# EAGLE design UWB_Light_Anchor (EAGLE 9.4.2)
COMPANY: ADAFRUIT INDUSTRIES; DRAWN: KTOWN; REV: G

## Sheet 1 of 2
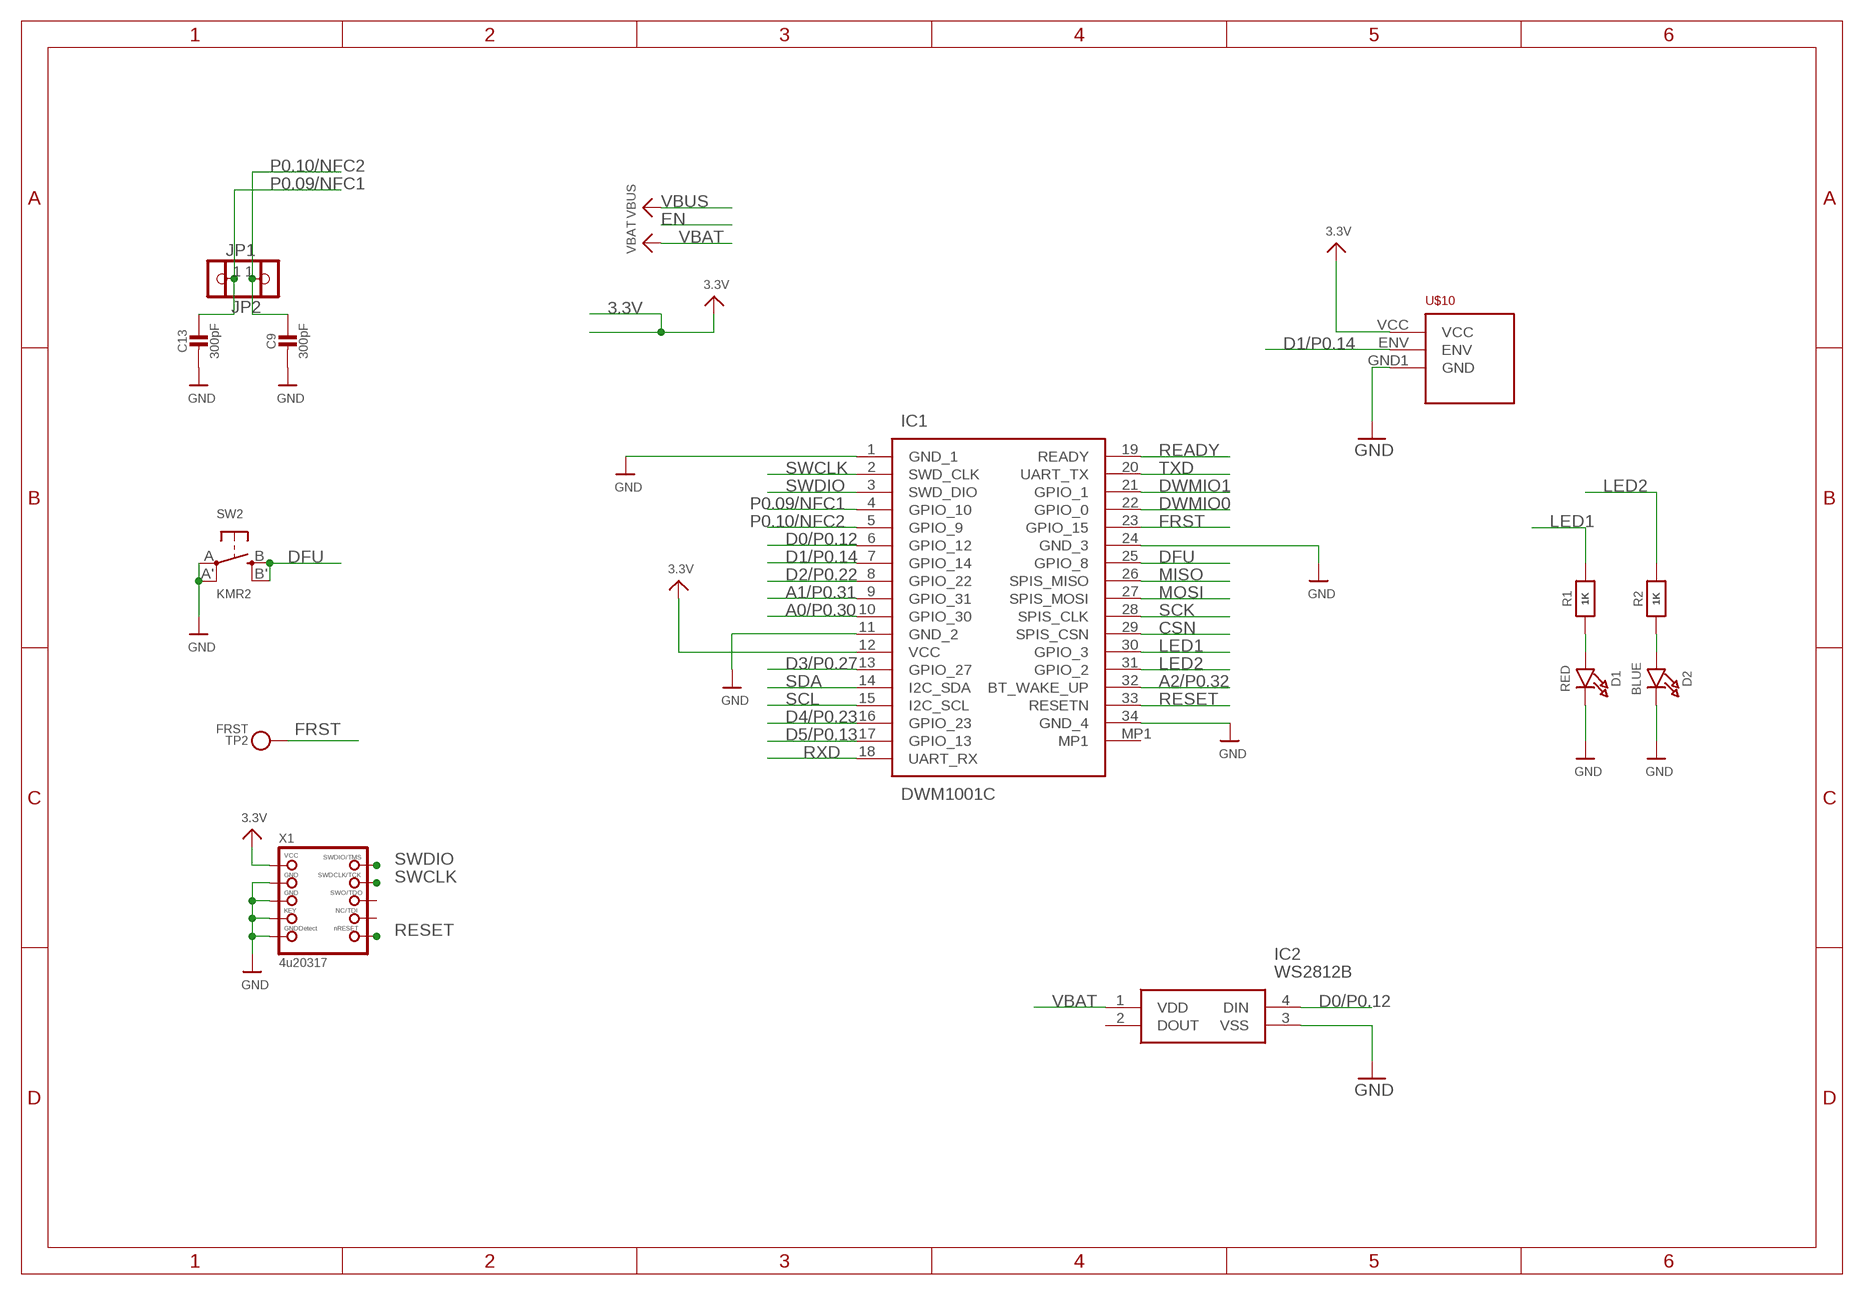
[diagram p0: schematic, sheet 1]

### Parts
C9  300pF  CAP_CERAMIC_0603MP  [_0603MP]
C13  300pF  CAP_CERAMIC_0603MP  [_0603MP]
D1  RED  LED0805_NOOUTLINE  [CHIPLED_0805_NOOUTLINE]
D2  BLUE  LED0805_NOOUTLINE  [CHIPLED_0805_NOOUTLINE]
IC1  DWM1001C  [DWM1001C]
IC2  WS2812B  [WS2812B]
JP1  HEADER-1X12MM  [1X01_2MM]
JP2  HEADER-1X12MM  [1X01_2MM]
R1  1K  RESISTOR_0603_NOOUT  [0603-NO]
R2  1K  RESISTOR_0603_NOOUT  [0603-NO]
SW2  KMR2  SWITCH_TACT_SMT4.6X2.8  [BTN_KMR2_4.6X2.8]
TP2  FRST  TESTPOINT1.5X2.0MM_NOCREAM  [PAD-1.5X2.0]
U$10  TS3633-CM1  [TS3633-CM1]
X1  4u20317  JTAG-CORTEXBOXPOSTS  [2X05_1.27MM_BOX_POSTS]

### Nets
3.3V: IC1.12(VCC) U$10.VCC X1.1(VCC) ; also sheet 2
A0/P0.30: IC1.10(GPIO_30) ; also sheet 2
A1/P0.31: IC1.9(GPIO_31)
A2/P0.32: IC1.32(BT_WAKE_UP)
CSN: IC1.29(SPIS_CSN)
D0/P0.12: IC1.6(GPIO_12) IC2.4(DIN)
D1/P0.14: IC1.7(GPIO_14) U$10.ENV
D2/P0.22: IC1.8(GPIO_22)
D3/P0.27: IC1.13(GPIO_27)
D4/P0.23: IC1.16(GPIO_23)
D5/P0.13: IC1.17(GPIO_13)
DFU: IC1.25(GPIO_8) SW2.B'(S1) SW2.B(S)
DWMIO0: IC1.22(GPIO_0)
DWMIO1: IC1.21(GPIO_1)
FRST: IC1.23(GPIO_15) TP2.P$1
GND: C9.2 C13.2 D1.C D2.C IC1.1(GND_1) IC1.11(GND_2) IC1.24(GND_3) IC1.34(GND_4) IC2.3(VSS) SW2.A'(P1) SW2.A(P) U$10.GND1(GND) X1.3(GND) X1.5(GND) X1.7(KEY) X1.9(GNDDETECT) ; also sheet 2
LED1: IC1.30(GPIO_3) R1.2
LED2: IC1.31(GPIO_2) R2.2
MISO: IC1.26(SPIS_MISO)
MOSI: IC1.27(SPIS_MOSI)
N$5: D1.A R1.1
N$7: D2.A R2.1
P0.09/NFC1: C13.1 IC1.4(GPIO_10) JP2.1
P0.10/NFC2: C9.1 IC1.5(GPIO_9) JP1.1
READY: IC1.19(READY)
RESET: IC1.33(RESETN) X1.10(NRESET) ; also sheet 2
RXD: IC1.18(UART_RX) ; also sheet 2
SCK: IC1.28(SPIS_CLK)
SCL: IC1.15(I2C_SCL)
SDA: IC1.14(I2C_SDA)
SWCLK: IC1.2(SWD_CLK) X1.4(SWDCLK)
SWDIO: IC1.3(SWD_DIO) X1.2(SWDIO)
TXD: IC1.20(UART_TX) ; also sheet 2
VBAT: IC2.1(VDD) ; also sheet 2
Unconnected: IC1.MP1 IC2.2(DOUT) X1.6(SWO) X1.8(TDI)

## Sheet 2 of 2
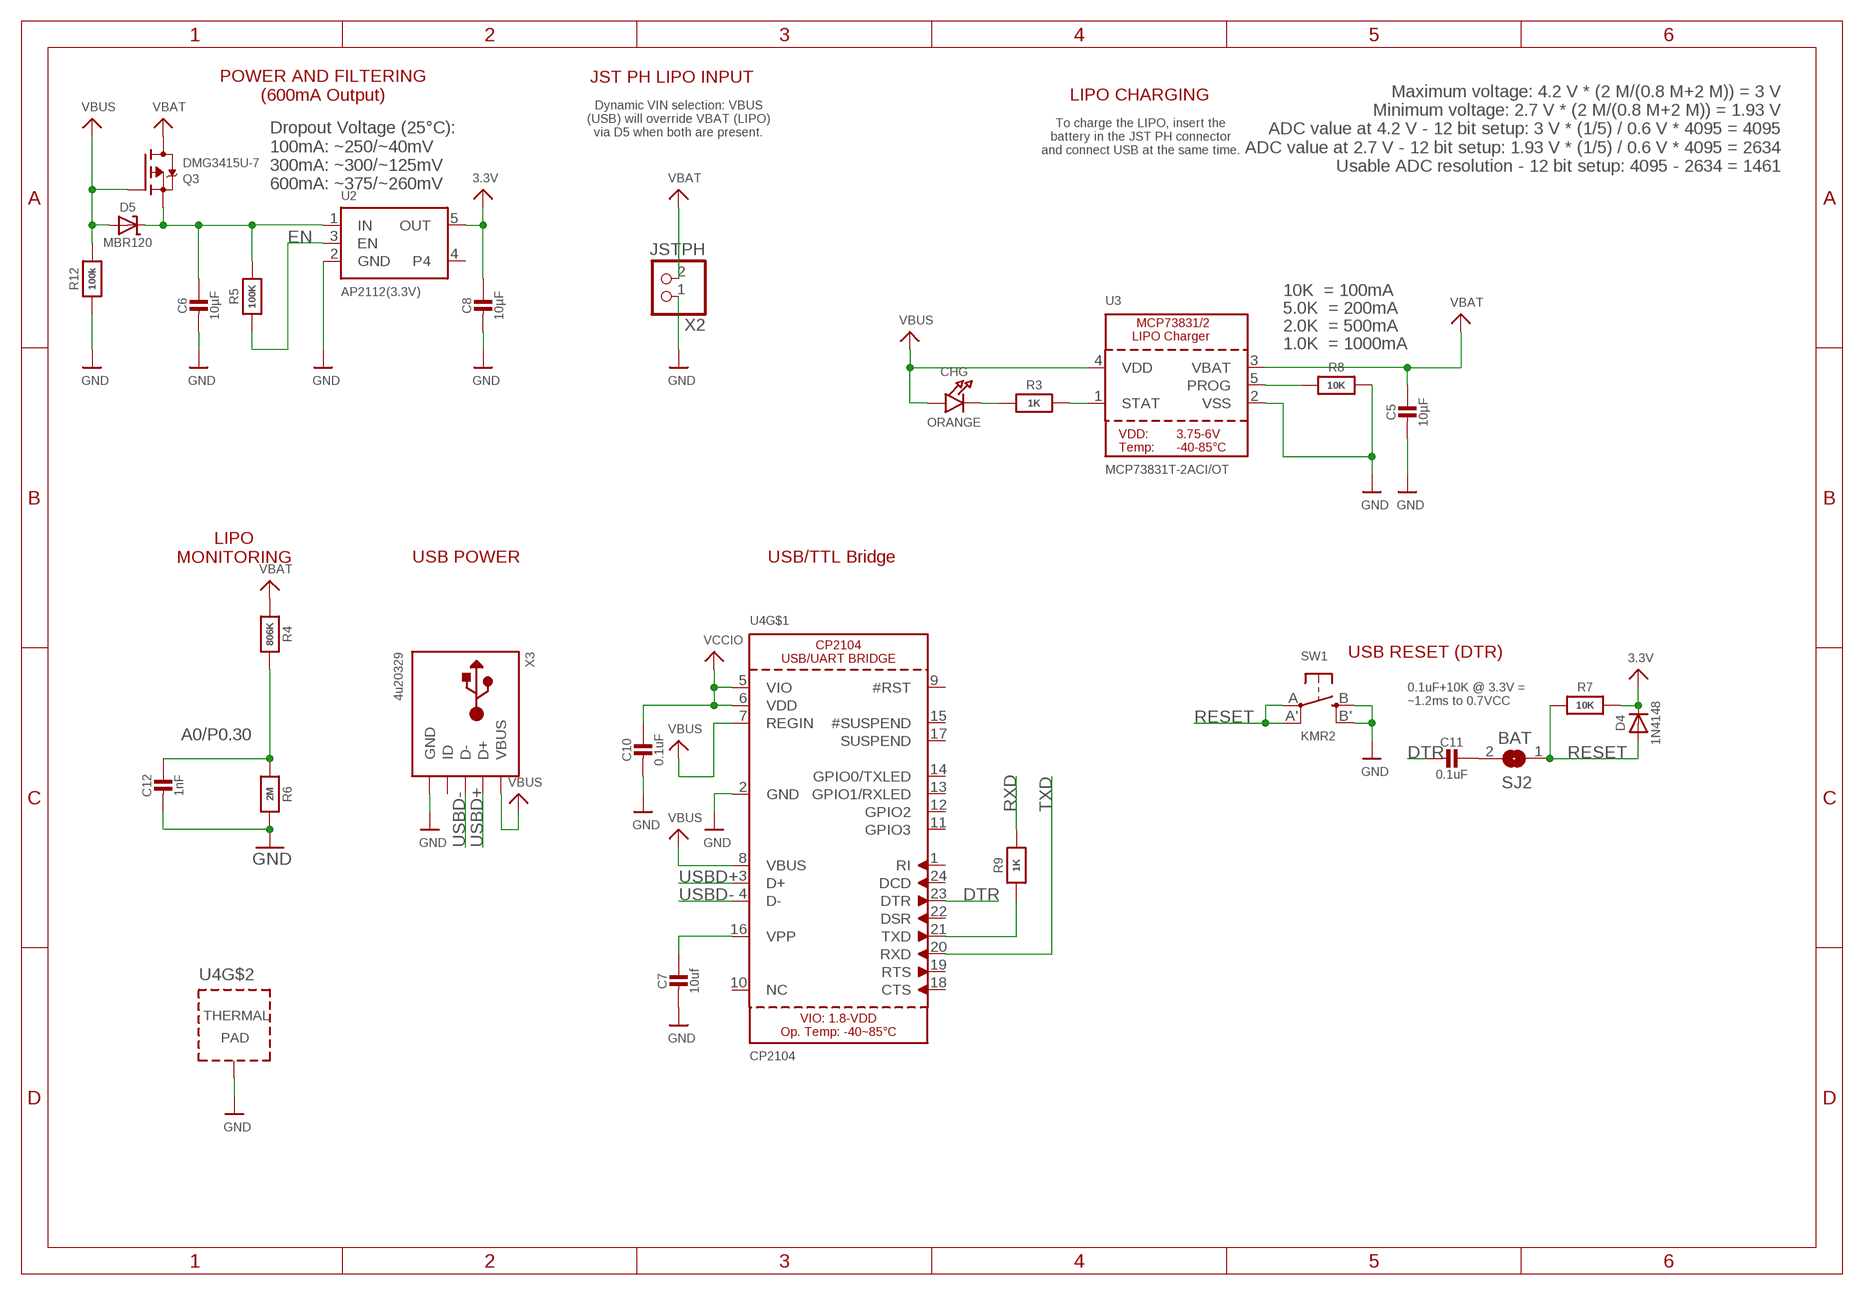
[diagram p1: schematic, sheet 2]

### Parts
C5  10µF  CAP_CERAMIC0805-NOOUTLINE  [0805-NO]
C6  10µF  CAP_CERAMIC0805-NOOUTLINE  [0805-NO]
C7  10uf  CAP_CERAMIC0805-NOOUTLINE  [0805-NO]
C8  10µF  CAP_CERAMIC0805-NOOUTLINE  [0805-NO]
C10  0.1uF  CAP_CERAMIC0603_NO  [0603-NO]
C11  0.1uF  CAP_CERAMIC0603_NO  [0603-NO]
C12  1nF  CAP_CERAMIC0603_NO  [0603-NO]
CHG  ORANGE  LED0805_NOOUTLINE  [CHIPLED_0805_NOOUTLINE]
D4  1N4148  DIODESOD-323  [SOD-323]
D5  MBR120  DIODE-SCHOTTKYSOD-123  [SOD-123]
Q3  DMG3415U-7  MOSFET-P  [SOT23-R]
R3  1K  RESISTOR_0603_NOOUT  [0603-NO]
R4  806K  RESISTOR_0603_NOOUT  [0603-NO]
R5  100K  RESISTOR_0603_NOOUT  [0603-NO]
R6  2M  RESISTOR_0603_NOOUT  [0603-NO]
R7  10K  RESISTOR_0603_NOOUT  [0603-NO]
R8  10K  RESISTOR_0603_NOOUT  [0603-NO]
R9  1K  RESISTOR_0603_NOOUT  [0603-NO]
R12  100k  RESISTOR_0603_NOOUT  [0603-NO]
SJ2  BAT  SOLDERJUMPERCLOSED  [SOLDERJUMPER_CLOSEDWIRE]
SW1  KMR2  SWITCH_TACT_SMT4.6X2.8  [BTN_KMR2_4.6X2.8]
U2  AP2112(3.3V)  VREG_SOT23-5  [SOT23-5]
U3  MCP73831T-2ACI/OT  MCP73831/2  [SOT23-5]
U4  CP2104  [QFN24_4MM_SMSC]
X2  JSTPH  CON_JST_PH_2PIN  [JSTPH2]
X3  4u20329  USB_MICRO_20329_V2  [4UCONN_20329_V2]

### Nets
3.3V: C8.1 D4.C R7.2 U2.5(OUT) ; also sheet 1
A0/P0.30: C12.1 R4.2 R6.1 ; also sheet 1
DTR: C11.2 U4.23(DTR)
EN: R5.1 U2.3(EN) ; also sheet 1
GND: C5.2 C6.2 C7.2 C8.2 C10.2 C12.2 R6.2 R8.2 R12.1 SW1.B'(S1) SW1.B(S) U2.2(GND) U3.2(VSS) U4.2(GND) U4.THERM(TP) X2.1 X3.BASE@1(GND) X3.BASE@2(GND) X3.GND X3.SPRT@1(GND) X3.SPRT@2(GND) X3.SPRT@3(GND) X3.SPRT@4(GND) ; also sheet 1
N$4: CHG.C R3.1
N$9: R3.2 U3.1(STAT)
N$10: R8.1 U3.5(PROG)
N$11: R9.1 U4.21(TXD)
N$13: C11.1 SJ2.2
N$14: C7.1 U4.16(VPP)
RESET: D4.A R7.1 SJ2.1 SW1.A'(P1) SW1.A(P) ; also sheet 1
RXD: R9.2 ; also sheet 1
TXD: U4.20(RXD) ; also sheet 1
USBD+: U4.3(D+) X3.D+
USBD-: U4.4(D-) X3.D-
VBAT: C5.1 Q3.3(D) R4.1 U3.3(VBAT) X2.2 ; also sheet 1
VBUS: CHG.A D5.A Q3.1(G) R12.2 U3.4(VDD) U4.7(REGIN) U4.8(VBUS) X3.VBUS ; also sheet 1
VCCIO: C10.1 U4.5(VIO) U4.6(VDD)
VIN: C6.1 D5.C Q3.2(S) R5.2 U2.1(IN)
Unconnected: U2.4 U4.1(RI) U4.9(#RST) U4.10(NC) U4.11(GPIO3) U4.12(GPIO2) U4.13(GPIO1/RXLED) U4.14(GPIO0/TXLED) U4.15(#SUSPEND) U4.17(SUSPEND) U4.18(CTS) U4.19(RTS) U4.22(DSR) U4.24(DCD) X3.ID

### Notes on the sheet
- JST PH LIPO INPUT
- POWER AND FILTERING
  (600mA Output)
- LIPO CHARGING
- Dynamic VIN selection: VBUS
  (USB) will override VBAT (LIPO)
  via D5 when both are present.
- To charge the LIPO, insert the
  battery in the JST PH connector
  and connect USB at the same time.
- Maximum voltage: 4.2 V * (2 M/(0.8 M+2 M)) = 3 V
  Minimum voltage: 2.7 V * (2 M/(0.8 M+2 M)) = 1.93 V
  ADC value at 4.2 V - 12 bit setup: 3 V * (1/5) / 0.6 V * 4095 = 4095
  ADC value at 2.7 V - 12 bit setup: 1.93 V * (1/5) / 0.6 V * 4095 = 2634
  Usable ADC resolution - 12 bit setup: 4095 - 2634 = 1461
- Dropout Voltage (25°C):
  100mA: ~250/~40mV
  300mA: ~300/~125mV
  600mA: ~375/~260mV
- 10K  = 100mA
- 5.0K  = 200mA
- 2.0K  = 500mA
- 1.0K  = 1000mA
- LIPO
  MONITORING
- USB POWER | USB/TTL Bridge
- USB RESET (DTR)
- 0.1uF+10K @ 3.3V =
  ~1.2ms to 0.7VCC

## Library data of the parts
C5-C13 = microbuilder:CAP_CERAMIC: Ceramic Capacitors For new designs, use the packages preceded by an '_' character since they are more reliable: The following footprints should be used on most boards: _0402 - Standard footprint for regular board layouts _0603 - Standard footprint for regular board layouts _0805 - Standard footprint for regular board layouts _1206 - Standard footprint for regular board layouts For extremely tight-pitch boards where space is at a premium, the following 'micro-pitch' footprints can be used (smaller pads, no silkscreen outline, etc.): _0402MP - Micro-pitch footprint for very dense/compact boards _0603MP - Micro-pitch footprint for very dense/compact boards _0805MP - Micro-pitch footprint for very dense/compact boards _1206MP - Micro-pitch footprint for very dense/compact boards
CHG D1 D2 = microbuilder:LED: LED 0603 - 0603 Surface Mount Package 2mA: Green LED - Low Power (3.9mcd, 2ma, 1.7Vf) - Digikey: 475-2709-2-ND Orange LED - Low Power (9.8mcd, 2ma, 1.8Vf) - Digikey: 475-1194-2-ND Red LED - Low Power (5mcd, 2ma, 1.8Vf) - Digikey: 475-1195-2-ND Yellow LED - Low Power (7mcd, 2ma, 1.8Vf) - Digikey: 475-1196-2-ND 5mA: Blue LED - Low Power (17mcd, 5ma, 2.9Vf) - Digikey: LNJ937W8CRACT-ND 0805 - 0805 Surface Mount Package 2mA: Red LED (8.8mcd, 2mA, 1.8Vf, Clear) - Low Power [Digikey: 475-2510-1-ND] Green LED (5mcd, 2mA, 1.8Vf, Clear) - Low Power [Digikey: 475-2730-1-ND] Yellow LED (11.3mcd, 2mA, 1.8Vf, Clear) - Low Power [Digikey: 475-2555-1-ND] 20mA: Red LED (104mcd, 20mA, Diffused) - LS R976 [Digikey: 475-1278-6-ND] Red LED (12mcd, 20mA, 2.0Vf, Clear) - APT2012EC [Digikey: 754-1128-1-ND] Green LED (15mcd, 20mA, 2.2Vf, Clear) - APT2012GC [Digikey: 754-1131-1-ND] Orange LED (160mcd, 20mA, 2.1Vf, Clear) - APT2012SECK [Digikey: 754-1130-1-ND] 1206 - 1206 Surface Mount Package Green LED (26mcd, 20mA, Diffused) - LG N971 [Digikey: 475-1407-6-ND] Red LED (15mcd, 20mA, Diffused) - LH N974 [Digikey: 475-1416-6-ND] Cree - Cree High-Power Surface Mount LEDs XPEBWT-L1-0000-00D50 - White 111lm 350mA 2.9Vf 6200K 110° XTEAWT-00-0000-00000LEE3 - White 114lm 350mA 2.85Vf 5000K 115° Everlight - Everlight 45-21 Series Surface Mount LEDs 45-21/QK2C-B2832AC2CB2/2T - Warm White 2000mcd 20mA 3.25Vf 3050K 120° 45-21/LK2C-B38452C4CB2/2T - Nuetral White 2000mcd 20mA 3.25Vf 4150K 120° 45-21/LK2C-B50634C6CB2/2T - Cold White 2200mcd 20mA 3.25Vf 5650K 120° PLCC2 Reverse Mount LS T77K-J1L2-1-0-2-R18-Z - Red 11.25mcd 2mA 1.8Vf 630nm 120° LO T77K-L1M2-24-Z - Orange 19.6mcd 2mA 1.8Vf 606nm 120° LY T77K-K2M1-26-Z - Yellow 15.7mcd 2mA 1.8Vf 587nm 120°
D4 = microbuilder:DIODE: Diode SMA Model Volts Amps Type Vf Ir Digikey # Notes SSA34-E3 40V 3A Schottky 480mV @ 3A 200uA @ 40V SSA34-E3/61TGITR-ND CDBA120-G 20V 1A Schottky 500mV @ 1A 500uA @ 20V 641-1014-6-ND REEL MBRA210 10V 2A Schottky 350mV @ 2A 700uA @ 10V MBRA210LT3 SOD-123 Model Volts Amps Type Vf Ir Order # Notes BAT54T1G 30V 200mA Schottky 800mV @ 200mA 2uA @ 25V BAT54T1GOSTR-ND B0530W 30V 500mA Schottky 430mV @ 500mA 130uA @ 30V B0530W-FDICT-ND REEL MBR120 20V 1A Schottky 340mV @ 1A MBR120VLSFT1GOSCT-ND SOD-323 Model Volts Amps Type Vf Ir Order # Notes PMEG2005EJ 20V 500mA Schottky 355mV @ 500mA 568-4110-1-ND ZLLS410 10V 570mA Schottky 380mV @ 570mA ZLLS410CT-ND 1N4148WS 75V 150mA Silicon/Simple 1V 1N4148WSFSCT-ND REEL SOD-523 Model Volts Amps Type Vf Ir Order # Notes BAT54XV2 30V 200mA Schottky 0.8V @ 100mA BAT54XV2CT-ND TB751S 30V 30mA Schottky RB751S-40TE61CT-ND SOT23-R/W (R = Solder Paste/Reflow Ovens, W = Hand-Soldering) Model Volts Amps Type Vf Ir Order # Notes BAT54FILM 40V 300mA Schottky 497-7162-1-ND POWERDI-5 Model Volts Amps Type Vf Ir Order # Notes PDS560 60V 5A Schottky 670mV @ 5A 150uA @ 60V PDS560DICT-ND
D5 = microbuilder:DIODE-SCHOTTKY
IC1 = DWM1001C:DWM1001C: RF TXRX MODULE UWB/BLUETOOTH RTL Source: Datasheet <https://www.decawave.com/wp-content/uploads/2019/01/DWM1001_Datasheet-1.4.pdf>; DESCRIPTION: RF TXRX MODULE UWB/BLUETOOTH RTL; HEIGHT: 3.4mm; MANUFACTURER_NAME: Decawave Limited; MANUFACTURER_PART_NUMBER: DWM1001C
IC2 = WS2812B:WS2812B: Intelligent control LED integrated light source Source: Datasheet <https://www.adafruit.com/datasheets/WS2812B.pdf>; DESCRIPTION: Intelligent control LED integrated light source; HEIGHT: mm; MANUFACTURER_NAME: Worldsemi; MANUFACTURER_PART_NUMBER: WS2812B
JP1 JP2 = microbuilder:HEADER-1X1: PIN HEADER
Q3 = microbuilder:MOSFET-P: P-Channel Mosfet LEGEND VDS: Voltage Drain-Source ID: Drain Current RDS(ON): Drain-Source On-State Resistance VGS(TH): Gate-Source Threshold Voltage CISS: Drain-Source Input Capacitance SOT-23 Name VDS ID RDS(ON) VGS(TH) CISS Order Number IRLML5103 30V 760mA 600 mOhm -- 75pF @ 25V Digikey: IRLML5103PBFCT-ND IRLML6401 12V 4.3A 50 mOhm 950mV @ 250µA 830pF @ 10V Digikey: IRLML6401PBFTR-ND NTR0202PL 20V 400mA 800 mOhm 2.3V @ 250uA 70pF @ 5V Digikey: NTR0202PLT1GOSTR-ND NTR4101PT1G 20V 1.8A 85 mOhm 1.2V @ 250uA 675pF @ 10V Digikey: NTR4101PT1GOSCT-ND DMP2004K 20V 600mA 900 mOhm 1V @ 250uA 175pF @ 16V Digikey: DMP2004KDICT-ND PMV65XP 20V 3.9A 76 mOhm 950mV @ 1mA 725pF @ 20V Digikey: 568-2358-2-ND TO-252 Name VDS ID RDS(ON) VGS(TH) CISS Order Number AOD417 30V 25A 34 mOhm 3V @ 250µA 920pF @ 15V Digikey: 785-1106-2-ND
R1-R9 R12 = microbuilder:RESISTOR: Resistors For new designs, use the packages preceded by an '_' character since they are more reliable: The following footprints should be used on most boards: _0402 - Standard footprint for regular board layouts _0603 - Standard footprint for regular board layouts _0805 - Standard footprint for regular board layouts _1206 - Standard footprint for regular board layouts For extremely tight-pitch boards where space is at a premium, the following 'micro-pitch' footprints can be used (smaller pads, no silkscreen outline, etc.): _0402MP - Micro-pitch footprint for very dense/compact boards _0603MP - Micro-pitch footprint for very dense/compact boards _0805MP - Micro-pitch footprint for very dense/compact boards _1206MP - Micro-pitch footprint for very dense/compact boards
SJ2 = microbuilder:SOLDERJUMPER: SMD Solder JUMPER Solder the two pads together to create a connection, or remove the solder to break it. REFLOW - Use this footprint for solder paste and reflow ovens. WAVE - Use this footprint for hand-soldering (larger pads). CLOSED - Has a trace between the two pads to ensure it is closed by default. The trace needs to be cut to disable the jumper, and can be closed again by creating a solder bridge between the two pads.
SW1 SW2 = microbuilder:SWITCH_TACT_SMT: SMT Tact Switches 6x6mm - Digikey: P12940SCT-ND KMR2 (4.6x2.8mm) - Digikey: 401-1426-1-ND EVQ-PQHB55 - Light Touch, 160GF (4.5x4.5mm) - Digikey: P8090SCT-ND KMT0 - KMT021 NGJ LHS (etc.) IP68/Waterproof - Digikey: CKN10289CT-ND
TP2 = microbuilder:TESTPOINT: Test Point Various test points for characterisation and PCB testing TESTPOINT_SMT - Compact Surface Mount Test Point [Digikey: 5016KTR-ND]
U2 = microbuilder:VREG_SOT23-5: SOT23-5 Fixed Voltage Regulators Part Current Out V Out V In V Dropout θJA (°C/W) TJ (°C) Digikey Part No. ADP121 150mA 3.3V 3.4-5.5V 0.09V @ 150mA -- -- ADP121-AUJZ33R7CT-ND ADP121 150mA 3.0V 3.1-5.5V 0.09V @ 150mA -- -- ADP121-AUJZ30R7CT-ND ADP122 300mA 3.3V 3.4-5.5V 0.085V @ 300mA -- -- ADP122AUJZ-3.3-R7CT-ND ADP1712 300mA 3.3V 3.5-5.5V 0.17V @ 300mA -- -- ADP1712AUJZ-3.3-R7TR-ND AP7311 (Low Cost) 150mA 3.3V 3.5-6V 0.15V @ 150mA -- -- AP7311-33WG-7DICT-ND LD39015M18R 150mA 1.8V 1.9V-5.5V 0.08V @ 100mA -- -- 497-6977-1-ND LP2985A-33DBVR 150mA 3.3V 3.3-16V 0.28V @ 150mA 206 150 296-18479-1-ND MCP1824T-3302E/OT 300mA 3.3V 3.5V-6V 0.2V @ 300mA -- -- MCP1824T-3302E/OTCT-ND MIC5205-2.5YM5 TR 150mA 2.5V 2.7-16V 0.165V @ 150mA -- -- 576-1257-2-ND MIC5205-3.0YM5 TR 150mA 3.0V 3.2V-16V 0.165V @ 150mA -- -- 576-1258-2-ND MIC5205-3.3YM5 TR 150mA 3.3V 3.5V-16V 0.165V @ 150mA -- -- 576-1259-2-ND TPS780330220 150mA 3.3V+2.2V 3.6-5.5V 250mV Max -- -- 296-23332-1-ND TDA3663/N1,135 100mA 3.3V 3.5-45V 0.18V @ 50mA -- -- 568-5343-1-ND Max operating temp can be calculated using θJA, TJ (max junction temperature), and power in watts. Set the "Maximum Ambient Temperature" until it reaches TJ ("Max Junction Temperature"), which is the absolute limit for safe use of the regulator: Heat Sink Temperature Calculator <http://www.daycounter.com/Calculators/Heat-Sink-Temperature-Calculator.phtml> For example, With 12V source into a 3.3V LP2985 and a 30mA load, we are dissipating (12V-3.3V) * 0.03A = 0.261W. With a θJA of 206 °C/W, a TJ of 150°C, and 261mW we can safely use the chip without a heat sink up to 75°C (=147.1°C Junction Temperature).
U3 = microbuilder:MCP73831/2: MCP73831/2 LIPO Charger VDD: 3.75 - 6V Temp -40 - 85°C Programmable Charge Rate: 15-500mA NOTE: STAT is a tri-state logic output on the MCP73831 and an open-drain output on the MCP73832. SOT23-5 with 4.2V output and tri-state logic on STAT = MCP73831T-2ACI/OT
U4 = microbuilder:CP2104: CP2104 - USB to UART Bridge VDD Output: 3.45V
U$10 = TS3633-CM1:TS3633-CM1: Triad’s TS3633-CM1 is a rapid-prototyping solution for creating a SteamVR™ Tracked Object. The TS3633-CM1 is a complete Light-to-Digital Converter on an easy to solder castellated module. The CM1 contains all the circuitry necessary to convert SteamVR Tracking base station infrared light into a digital output that encodes the angle of the sensor from the base station.
X1 = microbuilder:JTAG-CORTEX: Serial Wire (SW-DP) Connector Standard 0.05" 10-pin connector is for use with the Cortex M and Cortex A SWD (serial wire debugger) interface (SW-DP) Connectors 2x05_1.27MM_SMT - Inexpensive surface-mount header with bare pins, compatible with standard 10-pin SWD cables (4UCON: 16846) 2x05_1.27MM_BOX_NOPOSTS - Polarised surface-mount box (4UCON with caps: 19735, without caps: 15117 2x05_1.27MM_BOX_POSTS - Polarised surface-mount box with mounting holes (4UCON: 20317) Pinout: http://infocenter.arm.com/help/topic/com.arm.doc.faqs/attached/13634/cortex_debug_connectors.pdf http://www.keil.com/peripherals/coresight/connectors.asp
X2 = microbuilder:CON_JST_PH_2PIN: JST 2-Pin Right-Angle Connector PH-Series - 4UConnector: 17311 SH-Series - 4UConnector: 07278
X3 = microbuilder:USB: USB Connectors USBMINIB - Surface Mount Female Mini-B USB Connector 4UConnector: 06564

## Net classes
3 usbvcc: width 0.305 mm, drill 0.483 mm, clearance 0.203 mm

## Board
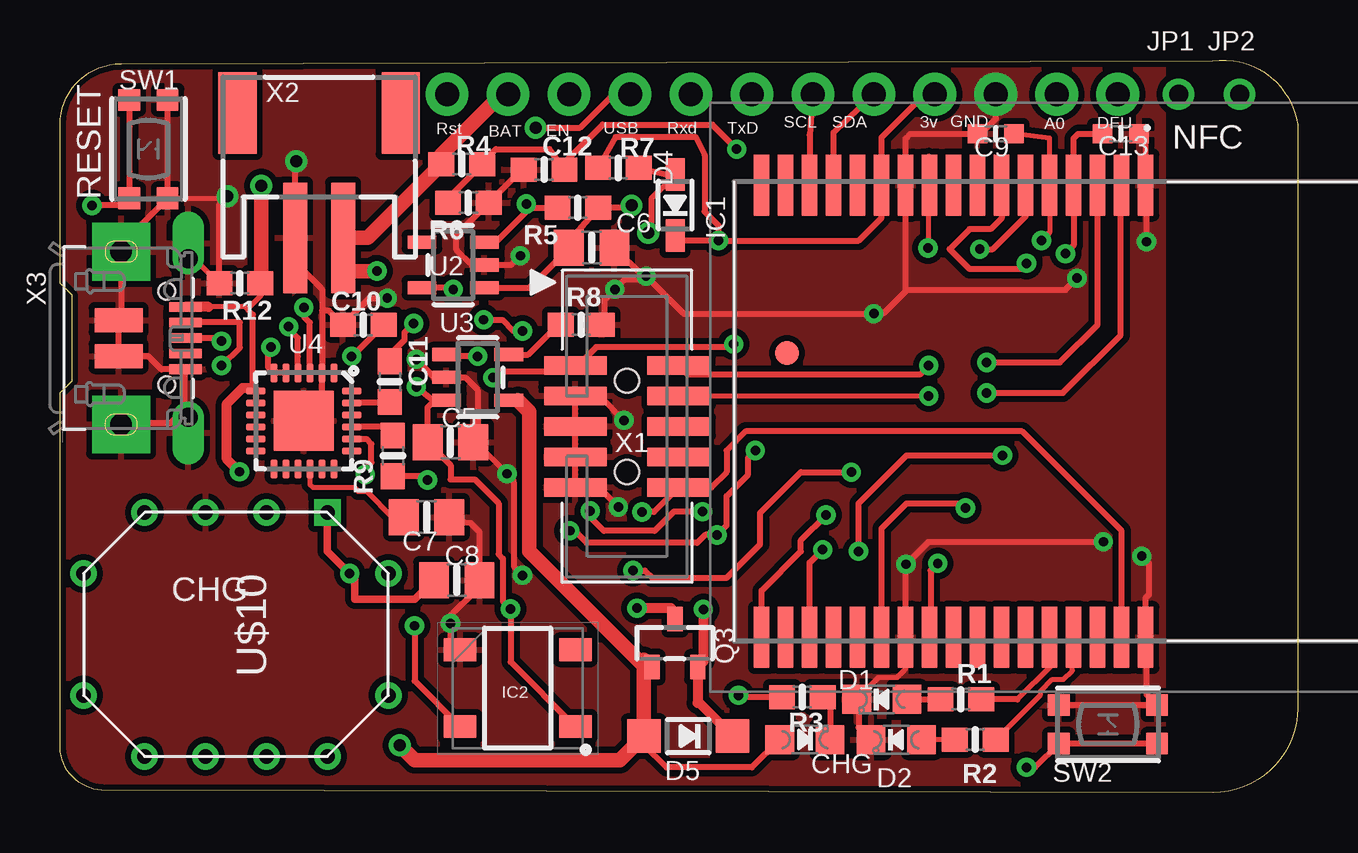
[diagram p2: board, top side]
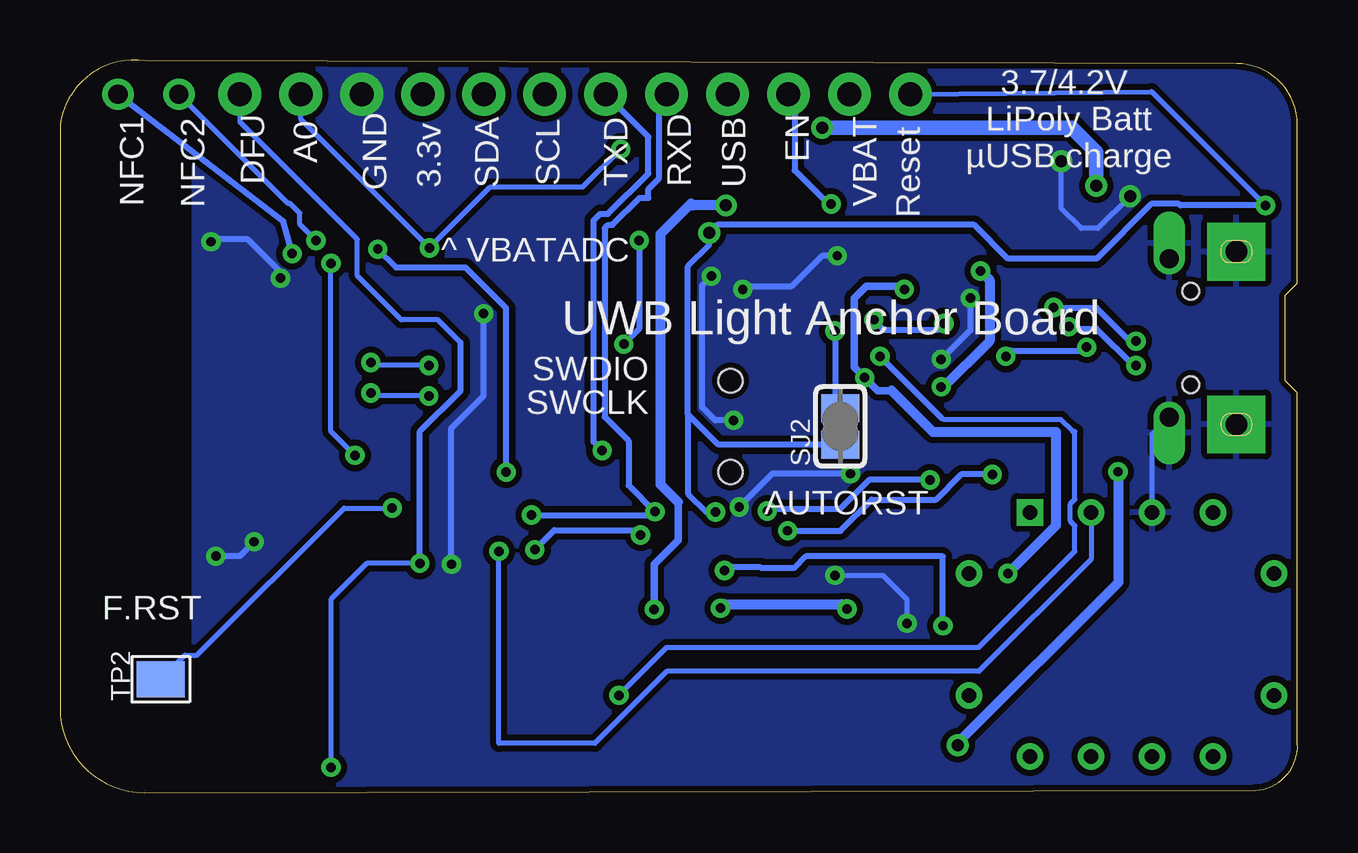
[diagram p3: board, bottom side, seen from below]

Size 51.56 x 30.53 mm. Coordinates in mm from the lower left corner, seen from the top.
Outline: 51.56,27.83 51.56,3.52 arc-90 48.04,0 1.74,0.1 arc-90 0,2.05 0,16.66 0.51,17.16 0.51,20.72 0,21.23 0,27.83 arc-90 2.54,30.37 48.01,30.5 arc-90 51.56,27.83
Copper layers (1*16): Top 0.035mm / dielectric 1.5mm / Bottom 0.035mm
Design rules "adafruit *": minimum track width 8mil, minimum drill 15.5mil, track to track 8mil, track to pad 8mil, pad to pad 8mil, via to via 8mil, smd to smd 8mil, copper to edge 10mil, drill to drill 8mil, minimum pad ring 10mil, minimum via ring 8mil, stop-mask expansion 2mil, vias tented up to drill 20mil, thermal gap 10mil

### Footprints (pad centres in the part's own frame; a part is rotated, then mirrored left to right if it is on the bottom)
0805-NO = smd 1.24 x 1.5: 1 -0.95,0; 2 0.95,0
_0603MP = smd 0.8 x 0.8: 1 -0.762,0; 2 0.762,0
0603-NO = smd 1.075 x 1: 1 -0.85,0; 2 0.85,0
CHIPLED_0805_NOOUTLINE = smd 1.2 x 1.2: A 0,-1.05; C 0,1.05
SOD-323 = smd 1.35 x 0.8: A 1.27,0; C -1.27,0
SOD-123 = smd 1.4 x 1.4: A 1.85,0; C -1.85,0
DWM1001C = smd 2.54 x 0.65: 1 -9.42,4.085; 2 -9.42,3.085; 3 -9.42,2.085; 4 -9.42,1.085; 5 -9.42,0.085; 6 -9.42,-0.915; 7 -9.42,-1.915; 8 -9.42,-2.915; 9 -9.42,-3.915; 10 -9.42,-4.915; 11 -9.42,-5.915; 12 -9.42,-6.915; 13 -9.42,-7.915; 14 -9.42,-8.915; 15 -9.42,-9.915; 16 -9.42,-10.915; 17 -9.42,-11.915; 18 9.42,-11.915; 19 9.42,-10.915; 20 9.42,-9.915; 21 9.42,-8.915; 22 9.42,-7.915; 23 9.42,-6.915; 24 9.42,-5.915; 25 9.42,-4.915; 26 9.42,-3.915; 27 9.42,-2.915; 28 9.42,-1.915; 29 9.42,-0.915; 30 9.42,0.085; 31 9.42,1.085; 32 9.42,2.085; 33 9.42,3.085; 34 9.42,4.085 | smd 1 x 1: MP1 -2.435,-10.865
WS2812B = smd 1.35 x 0.95: 1 -2.4,1.6; 2 -2.4,-1.6; 3 2.4,-1.6; 4 2.4,1.6
1X01_2MM = drill 0.8 pad 1.27: 1 0,0
SOT23-R = smd 0.635 x 1.016: 1 -0.95,-1; 2 0.95,-1; 3 0,1
SOLDERJUMPER_CLOSEDWIRE = smd 1.168 x 1.6: 1 -0.762,0; 2 0.762,0 | smd 0.635 x 0.203: WIRE 0,0
BTN_KMR2_4.6X2.8 = smd 0.9 x 0.9: A 2.05,0.8; A' -2.05,0.8; B 2.05,-0.8; B' -2.05,-0.8
PAD-1.5X2.0 = smd 1.5 x 2: P$1 0,0
SOT23-5 = smd 0.55 x 1.2: 1 -0.95,-1.3; 2 0,-1.3; 3 0.95,-1.3; 4 0.95,1.3; 5 -0.95,1.3
QFN24_4MM_SMSC = smd 0.8 x 0.28: 1 -2,1.25; 2 -2,0.75; 3 -2,0.25; 4 -2,-0.25; 5 -2,-0.75; 6 -2,-1.25; 13 2,-1.25; 14 2,-0.75; 15 2,-0.25; 16 2,0.25; 17 2,0.75; 18 2,1.25 | smd 0.28 x 0.8: 7 -1.25,-2; 8 -0.75,-2; 9 -0.25,-2; 10 0.25,-2; 11 0.75,-2; 12 1.25,-2; 19 1.25,2; 20 0.75,2; 21 0.25,2; 22 -0.25,2; 23 -0.75,2; 24 -1.25,2 | smd 2.5 x 2.5: THERM 0,0
TS3633-CM1 = drill 0.6: ENV -7.62,5.08; GND1 -7.62,2.54; GND2 2.54,2.54; NC1 -7.62,0; NC2 2.54,7.62; NC3 2.54,5.08; NC4 2.54,0; P$9 -5.08,-2.54; P$10 0,-2.54; P$11 -5.08,10.16; P$12 0,10.16 | drill 0.6 square: VCC -7.62,7.62
2X05_1.27MM_BOX_POSTS = smd 0.76 x 2.6: 1 -2.54,-2.15; 2 -2.54,2.15; 3 -1.27,-2.15; 4 -1.27,2.15; 5 0,-2.15; 6 0,2.15; 7 1.27,-2.15; 8 1.27,2.15; 9 2.54,-2.15; 10 2.54,2.15 | hole 1: -1.905,0; 1.905,0
JSTPH2 = smd 1 x 4.6: 1 -1,-3.7; 2 1,-3.7 | smd 1.6 x 3.4: NC1 -3.4,1.5; NC2 3.4,1.5
4UCONN_20329_V2 = smd 1 x 2: BASE@1 -0.75,-2; BASE@2 0.75,-2 | smd 0.4 x 1.35: D+ 0,0.775; D- -0.65,0.775; GND 1.3,0.775; ID 0.65,0.775; VBUS -1.3,0.775 | drill 0.8 pad 1.143 offset: SPRT@1 -3.3,0.9; SPRT@2 3.3,0.9 | drill 0.9 pad 2.413 square: SPRT@3 -3.6,-1.9; SPRT@4 3.6,-1.9 | hole 0.7: -1.95,0; 1.95,0

### Placement (x,y rotation side)
C5  16.27,14.6 0 top
C6  22.15,22.71 0 top
C7  15.27,11.49 0 top
C8  16.53,8.85 0 top
C9  38.99,27.45 180 top
C10  12.64,19.5 180 top
C11  13.74,17.12 270 top
C12  20.17,25.96 180 top
C13  44.2,27.45 0 top
CHG  31.03,2.21 270 top
D1  34.25,3.89 90 top
D2  34.84,2.2 90 top
D4  25.63,24.48 90 top
D5  26.18,2.35 180 top
IC1  41.15,15.89 270 top
IC2  19.07,4.35 180 top
JP1  46.61,29.1 0 top
JP2  49.15,29.1 0 top
Q3  25.62,6.23 0 top
R1  37.54,3.89 0 top
R2  38.14,2.21 0 top
R3  30.93,3.98 180 top
R4  16.74,26.19 0 top
R5  21.58,24.38 0 top
R6  17.02,24.58 0 top
R7  23.27,26.03 180 top
R8  21.72,19.5 0 top
R9  13.87,14.03 270 top
R12  7.49,21.23 0 top
SJ2  19.05,15.26 90 bottom
SW1  3.68,26.82 90 top
SW2  43.66,2.85 0 top
TP2  47.36,4.73 270 bottom
U2  16.38,21.99 90 top
U3  17.4,17.3 270 top
U4  10.16,15.49 270 top
U$10  3.52,4.05 270 top
X1  23.62,15.26 270 top
X2  10.8,26.82 0 top
X3  4.45,18.94 270 top

### Tracks (layer width: path | path; a pad name or v marks a point on that pad's centre or on a via)
3.3V  (via drill 0.39, 1 pad 1.78)
  Top 0.203: 21.52,17.75 X1.1 | 25.83,23.01 D4.C
  Top 0.254: R7.2 23.15,27.32 26.48,27.32 26.86,26.56 26.86,24.21 27.43,23.64 v27.43,23.01 | v16.38,20.97 16.32,21.04 U2.5 | X1.1 21.22,17.54 18.29,17.54 v18.04,17.29 | 21.52,17.75 22.34,18.56 27.94,18.56 v28.07,18.69 | v27.43,23.01 25.83,23.01 | v27.43,23.01 33.28,23.01 34.23,23.96 IC1.12 34.23,27.3 36.07,29.14 v36.45,29.1
  Top 0.305: C8.1 14.78,8.05 12.27,8.05 12.27,8.93 v12.07,9.13 11.14,10.06 U$10.VCC
  Bottom 0.254: v27.43,23.01 27.43,19.32 v28.07,18.69
  Bottom 0.305: 16.92,16.75 17.5,16.75 v18.04,17.29 18.48,17.73 18.48,20.59 17.97,21.1 16.51,21.1 v16.38,20.97
  Bottom 0.406: v12.07,9.13 10.07,11.13 10.07,15.03 15.2,15.03 16.92,16.75
A0/P0.30  (via drill 0.39, 1 pad 1.78)
  Top 0.203: IC1.10 36.23,26.51 36.17,26.51 v36.17,22.7
  Top 0.254: R6.1 16.17,24.77 R4.2 17.84,26.45 17.84,26.5 18.16,26.82 20.39,26.82 C12.1 21.02,26.24 22.61,27.83 27.18,27.83 v28.2,26.81
  Bottom 0.203: v28.2,26.81 29.77,25.24 33.63,25.24 v36.17,22.7 41.53,28.06 v41.53,29.1
D0/P0.12  (via drill 0.39)
  Top 0.254: v23.87,9.25 24.37,9.25 24.67,8.95 25.27,8.95 25.28,8.95 27.77,8.95 29.17,10.35 29.17,11.65 30.87,13.35 v32.97,13.35 | IC1.6 40.23,24.02 38.86,22.64 v38.32,22.64 | v14.77,6.95 14.77,4.65 IC2.4
  Bottom 0.254: v14.77,6.95 14.77,9.85 20.48,9.85 20.97,9.35 22.34,9.35 22.37,9.38 23.74,9.38 v23.87,9.25 | v32.97,13.35 32.97,20.18 34.67,21.88 37.56,21.88 v38.32,22.64
D1/P0.14  (via drill 0.39)
  Top 0.254: v33.27,10.05 33.27,12.05 35.27,14.05 v39.27,14.05 | v40.27,22.05 40.03,21.81 37.9,21.81 37.07,22.64 37.9,23.48 38.78,23.48 39.23,23.93 IC1.7
  Bottom 0.203: U$10.ENV 8.6,9.72 13.27,5.05 26.27,5.05 29.27,2.05 33.27,2.05 v33.27,10.05 | v39.27,14.05 40.27,15.05 v40.27,22.05
DFU  (via drill 0.39, 1 pad 1.78)
  Top 0.254: SW2.B SW2.B' 40.62,1.05 v40.27,1.05 | IC1.25 36.27,6.51 36.27,9.25 v36.57,9.55
  Bottom 0.203: v44.07,29.1 44.07,27.95 39.17,23.05 39.17,21.54 37.34,19.7 35.82,19.7 34.87,18.75 | v36.57,9.55 38.77,9.55 40.27,8.05 v40.27,1.05
  Bottom 0.254: v36.57,9.55 36.57,15.05 34.87,16.75 34.87,18.75
DTR
  Top 0.254: C11.2 13.7,16.24 U4.23
EN  (via drill 0.39, 1 pad 1.78)
  Top 0.203: v19.43,24.53 19.58,24.38
  Top 0.254: R5.1 19.58,24.38 18.15,22.94 U2.3
  Bottom 0.254: v21.21,29.1 20.82,28.71 20.96,28.37 20.96,25.93 19.56,24.53 v19.43,24.53
FRST  (via drill 0.39)
  Top 0.254: IC1.23 34.23,11.02 35.27,12.05 37.53,12.05 v37.73,11.86
  Bottom 0.203: TP2.P$1 46.36,5.73 45.86,5.73 39.73,11.86 v37.73,11.86
GND  (via drill 0.39, 0.5, 1 pad 1.78)
  Top 0.203: R8.2 22.75,19.68 | 45.23,27.18 C13.2 | X2.1 9.8,22.1 | U4.2 10.92,17.5 | 45.23,7.05 IC1.34 45.27,6.44 | C7.2 16.41,11.3 | IC2.3 16.27,6.35 | C5.2 17.32,14.6 v18.63,13.29 18.91,13 18.91,12.91 | X3.SPRT@1 5.47,22.37 6.61,21.23 R12.1 | SW1.B' 6.89,24.77 v6.98,24.85 | X3.SPRT@2 5.18,15.81 5.18,15.98 | D1.C 34.1,4.79 34.87,4.79 35.23,5.15 IC1.24
  Top 0.254: C12.2 19.17,25.88 R6.2 16.51,23.22 16.51,22.62 17.15,21.99 U2.2 18.8,21.99 v19.18,22.37 | SW2.A' SW2.A 45.27,4.09 45.27,6.44 | SW1.B SW1.B' 2.55,22.83 X3.SPRT@3 2.55,19.79 X3.BASE@1 X3.BASE@2 3.67,18.19 4.22,17.64 X3.GND 5.18,17.6 5.18,15.98 4.58,15.39 2.59,15.39 X3.SPRT@4 | 45.23,27.18 IC1.1 45.27,25.28 v45.27,22.95 | X2.1 9.8,26.26 v9.84,26.31 | R12.1 6.64,24.52 v6.98,24.85 | 9.8,22.1 10.92,20.97 10.92,20.08 | 10.92,20.08 10.92,17.5 | U4.2 10.91,16.49 10.16,15.74 U4.THERM | 22.75,19.68 22.69,19.75 22.69,20.55 v23.12,20.97 23.53,21.39 24.55,21.39 | 35.23,20.9 IC1.11 35.23,27.25 35.43,27.45 C9.2 38.36,27.45 38.99,28.09 v38.99,29.1 | C6.2 24.3,21.52 v24.42,21.52 24.55,21.39 | 24.55,21.39 25.98,19.96 v33.91,19.96 34.29,19.96 35.23,20.9 | C5.2 17.4,14.78 17.4,16.78 16.88,17.3 U3.2 15.6,17.3 v14.85,18.05 | v23.26,11.9 22.45,12.72 X1.9 X1.7 X1.5 X1.3 22.48,16.53 v23.5,15.51 | 10.92,20.08 11.2,20.08 C10.2 12.89,20.6 v13.63,20.6 | IC1.24 35.23,9.54 v35.25,9.52 36.17,10.44 36.17,10.45 v43.47,10.45 | v45.07,9.85 45.37,9.55 45.37,8.25 45.23,8.12 45.23,7.05 | 35.23,20.9 35.29,20.95 41.89,20.95 v42.37,21.44 | 16.41,11.3 17.1,11.23 17.48,10.86 C8.2 17.48,8.57 16.15,7.24 16.15,7.18 v16.27,7.05 16.27,6.35 | v19.27,9.05 18.91,9.41 18.91,12.91 | D1.C 33.28,3.81 33.28,2.72 D2.C
  Bottom 0.203: v6.98,24.85 8.31,23.51 9.02,23.51 9.84,24.34 v9.84,26.31 | v19.27,9.05 17.27,9.05 16.27,8.05 v16.27,7.05 | U$10.GND1 6.06,14.93 X3.SPRT@2
  Bottom 0.254: v19.18,22.37 19.81,22.37 21.08,21.1 22.99,21.1 v23.12,20.97 | v18.63,13.29 21.88,13.29 v23.26,11.9 | v13.63,20.6 13.63,19.26 v14.85,18.05 | v35.25,9.52 35.25,15.19 33.91,16.53 v33.91,19.96 | v24.42,21.52 24.8,21.14 24.8,16.06 24.26,15.51 v23.5,15.51 | v43.47,10.45 44.07,9.85 v45.07,9.85 | v42.37,21.44 42.37,21.69 43.73,23.05 45.27,23.05 v45.27,22.95
  pour Bottom (isolate 0.254): 45.98,0 0,0 0,30.37 45.98,30.37
  pour Top (isolate 0.254): 45.95,0 0,0 0,30.37 45.95,30.37
LED1
  Top 0.203: IC1.30 41.25,6.45 41.25,5.25 39.89,3.89
  Top 0.254: 39.89,3.89 R1.2
LED2
  Top 0.203: IC1.31 42.18,6.42 42.18,5.09 41.81,4.72 41.35,4.72 40.86,4.22 40.86,4.08 R2.2
N$4
  Top 0.254: R3.1 32.08,3.68 CHG.C
N$5
  Top 0.254: D1.A R1.1
N$7
  Top 0.203: R2.1 D2.A
  Top 0.254: D2.A
N$9  (via drill 0.39)
  Top 0.254: v17.4,18.18 16.17,18.18 U3.1 | R3.2 28.34,3.98 v28.27,4.05
  Bottom 0.203: v28.27,4.05 26.27,6.05 13.27,6.05 9.27,10.05 9.27,11.13 9.46,11.32 9.46,12.03 9.27,12.22 9.27,15.05 9.38,15.05 9.86,15.54 14.76,15.54 14.83,15.6
  Bottom 0.254: v17.4,18.18 14.83,15.6
N$10
  Top 0.254: U3.5 19.51,18.25 20.75,19.5 R8.1
N$11
  Top 0.254: U4.21 13.56,15.24 13.87,14.92 R9.1
N$13  (via drill 0.39)
  Top 0.254: v17.65,19.7 18.42,19.7 18.89,19.23 v19.27,19.23 | v14.73,19.55 14.36,19.17 14.36,18.86 13.74,18.25 C11.1
  Bottom 0.254: v17.65,19.7 17.25,19.3 14.99,19.3 v14.73,19.55 | v19.27,19.23 19.27,16.24 SJ2.2
N$14
  Top 0.203: 13.84,11.49 12.77,12.55 12.43,12.55 12.26,12.72 10.54,12.72 10.42,12.85 U4.16
  Top 0.254: 13.84,11.49 C7.1
P0.09/NFC1  (via drill 0.39)
  Top 0.254: v41.89,22.46 42.23,22.8 IC1.4 42.23,27.27 42.42,27.45 C13.1
  Bottom 0.254: v41.89,22.46 42.25,23.8 JP2.1
P0.10/NFC2  (via drill 0.39)
  Top 0.203: C9.1 41.23,27.27 IC1.5 41.23,23.34 v40.9,23.01
  Bottom 0.203: v40.9,23.01 41.57,23.68 41.57,24.14 41.98,24.56 42.07,24.56 JP1.1
RESET  (via drill 0.39, 0.5, 1 pad 1.78)
  Top 0.203: 25.59,25.69 25.65,25.74
  Top 0.254: R7.1 25.59,25.69 24.64,24.74 24.64,23.45 v24.51,23.32 | 25.65,25.74 D4.A | v24.25,11.69 24.75,11.69 X1.10 27.14,12.72 27.77,13.35 27.77,14.25 28.57,15.05 40.08,15.05 44.23,10.9 IC1.33 | SW1.A SW1.A' 2.59,24.47 v1.34,24.47
  Bottom 0.203: v16.13,29.1 6.07,29.2 v1.34,24.47
  Bottom 0.254: 25.38,15.75 25.4,15.77 25.4,21.93 24.51,22.81 v24.51,23.32 24.18,23.65 13.47,23.65 12.07,22.25 8.37,22.25 6.09,24.53 4.94,24.53 4.87,24.47 v1.34,24.47 | 25.38,15.75 24.13,14.5 SJ2.1 | v24.25,11.69 24.64,11.69 25.38,12.44 25.38,15.75
RXD  (via drill 0.39, 1 pad 1.78)
  Top 0.254: v15.31,13.03 15.16,13.18 R9.2 | v22.09,11.74 22.09,11.48 22.66,10.91 24.77,10.91 25.57,11.71 v26.77,11.71 | IC1.18 29.23,8.41 30.87,10.05 30.87,10.52 v31.92,11.57
  Bottom 0.254: v15.31,13.03 17.85,13.03 19.05,11.84 21.99,11.84 v22.09,11.74 | v31.92,11.57 26.91,11.57 v26.77,11.71 27.87,12.8 27.87,14.65 28.87,15.65 28.87,23.51 28.73,23.65 28.54,23.65 27.41,24.78 27.05,24.78 27.05,25.14 26.6,25.6 26.6,28.87 v26.29,29.1
SCL  (via drill 1 pad 1.78)
  Top 0.254: v31.37,29.1 31.23,27.41 IC1.15
SDA  (via drill 1 pad 1.78)
  Top 0.254: IC1.14 32.23,27.5 v33.91,29.1
SWCLK  (via drill 0.39)
  Top 0.203: X1.4 v36.2,16.53 | 44.2,25.28 IC1.2
  Top 0.254: v38.61,16.66 41.78,16.66 44.2,19.07 44.2,25.28
  Bottom 0.203: v36.2,16.53 38.48,16.53 v38.61,16.66
SWDIO  (via drill 0.39)
  Top 0.254: X1.2 26.15,17.42 35.82,17.42 v36.2,17.8 | v38.61,17.93 41.66,17.93 43.23,19.5 IC1.3
  Bottom 0.203: v36.2,17.8 38.48,17.8 v38.61,17.93
TXD  (via drill 0.39, 1 pad 1.78)
  Top 0.254: U4.20 12.75,14.74 12.97,14.52 12.97,13.75 12.72,13.5 v12.72,13.26 | v21.25,10.91 21.45,10.91 21.95,10.41 26.55,10.41 26.88,10.74 v27.38,10.74 27.77,11.13 27.77,12.35 28.67,13.25 28.67,13.95 v28.97,14.25 | v31.78,10.12 31.23,9.58 IC1.20
  Bottom 0.203: v28.83,29.1 28.83,28.59
  Bottom 0.254: v31.78,10.12 30.97,10.94 27.58,10.94 v27.38,10.74 | v12.72,13.26 14.02,13.26 15.06,12.21 17.75,12.21 19.05,10.91 v21.25,10.91 | v28.97,14.25 29.33,14.61 29.33,23.84 29.06,24.11 28.73,24.11 27.05,25.79 27.05,27.32 28.32,28.59 28.83,28.59
USBD+  (via drill 0.39)
  Top 0.254: v6.73,18.81 6.61,18.94 X3.D+ | U4.3 10.41,19.58 10.16,19.83 v10.16,20.21
  Bottom 0.254: v10.16,20.21 8.38,20.21 6.99,18.81 v6.73,18.81
USBD-  (via drill 0.39)
  Top 0.254: U4.4 9.91,18.18 9.91,18.94 9.53,19.32 v9.53,19.42 | v6.73,17.8 6.75,17.8 7.49,18.54 7.49,19.59 X3.D-
  Bottom 0.254: v9.53,19.42 9.44,19.33 8.38,19.33 6.85,17.8 v6.73,17.8
VBAT  (via drill 0.39, 1 pad 1.78)
  Top 0.254: 15.62,16.35 15.32,16.05 C5.1 16.27,13.65 16.27,13.05 17.27,13.05 18.27,12.05 18.27,9.94 18.46,9.75 18.46,7.97 v18.77,7.65 18.77,5.45 IC2.1 | U3.3 15.42,16.44 v14.85,16.91 | X2.2 11.8,21.73
  Top 0.406: R4.1 15.89,26.57 | U3.3 15.62,16.35 | v24.04,7.68 25.47,7.68 Q3.3
  Top 0.61: X2.2 12.81,23.12 R4.1 | v18.67,29.1 18.37,29.05 15.89,26.57 | 11.8,21.73 v13.21,21.73
  Bottom 0.406: v13.21,21.73 12.83,21.35 12.83,18.81 14.73,16.91 v14.85,16.91 | v18.77,7.65 18.97,7.85 23.87,7.85 v24.04,7.68
VBUS  (via drill 0.39, 0.5, 1 pad 1.78)
  Top 0.203: 7.81,20.15 8.03,19.93 | 7.81,20.15 7.72,20.24 6.19,20.24 | 7.81,20.15 8.38,20.72 8.38,21.27 | 24.33,2 D5.A
  Top 0.254: v19.81,27.7 21.67,27.7 23.07,29.1 v23.75,29.1 | 8.03,16.86 8.03,19.93 | U4.7 U4.8 | CHG.A 28.83,1.05 25.27,1.05 24.33,2
  Top 0.406: 6.19,20.24 X3.VBUS | v7.48,13.37 6.95,13.9 6.95,16.2 7.61,16.86 8.03,16.86 U4.7 | U3.4 19.08,16.35 | 24.33,5.53 Q3.1 24.38,5.23
  Top 0.61: R12.2 8.38,21.27 v8.38,25.29 | v14.16,1.97 14.77,1.35 23.33,1.35 D5.A 24.33,5.53 | 19.08,16.35 19.56,15.88 19.56,10.05 24.38,5.23
  Bottom 0.406: v14.16,1.97 14.16,2.07 7.46,8.77 7.46,13.35 v7.48,13.37
  Bottom 0.61: v8.38,25.29 8.38,26.69 9.4,27.7 v19.81,27.7
VCCIO  (via drill 0.39)
  Top 0.254: U4.5 U4.6 8.66,17.74 8.66,18.43 v8.78,18.56 | C10.1 12.29,18.31 12.28,18.31 v12.15,18.18
  Bottom 0.254: v8.78,18.56 8.93,18.41 11.92,18.41 v12.15,18.18
VIN  (via drill 0.39, 0.5)
  Top 0.254: v23.81,24.47 23.73,24.38 R5.2 20.96,22.68 | 21.2,22.68 20.07,21.55 19.56,21.04 U2.1
  Top 0.305: 20.96,22.68 C6.1 21.2,22.68
  Top 0.406: v26.81,7.64 26.81,5.46 Q3.2 26.57,3.73 26.63,3.75 D5.C
  Bottom 0.305: v26.81,7.64 26.81,9.52 25.81,10.52 25.81,12.11
  Bottom 0.406: v23.81,24.47 25.2,24.47 25.27,24.54 26.54,23.27 26.54,12.85 25.81,12.11

### Text on the board
tPlace: Rst | BAT | EN | USB | Rxd | TxD | SCL | SDA | 3v | GND | A0 | DFU | RESET | NFC | CHG
bPlace: 3.7/4.2V / LiPoly Batt / µUSB charge | EN | USB | RXD | TXD | SCL | SDA | 3.3v | GND | A0 | DFU | Reset | VBAT | NFC2 | NFC1 | ^ VBATADC | UWB Light Anchor Board | SWDIO | SWCLK | AUTORST | F.RST